# Altium schematic sheet DPPXHK_IO.SCHDOC
size A4
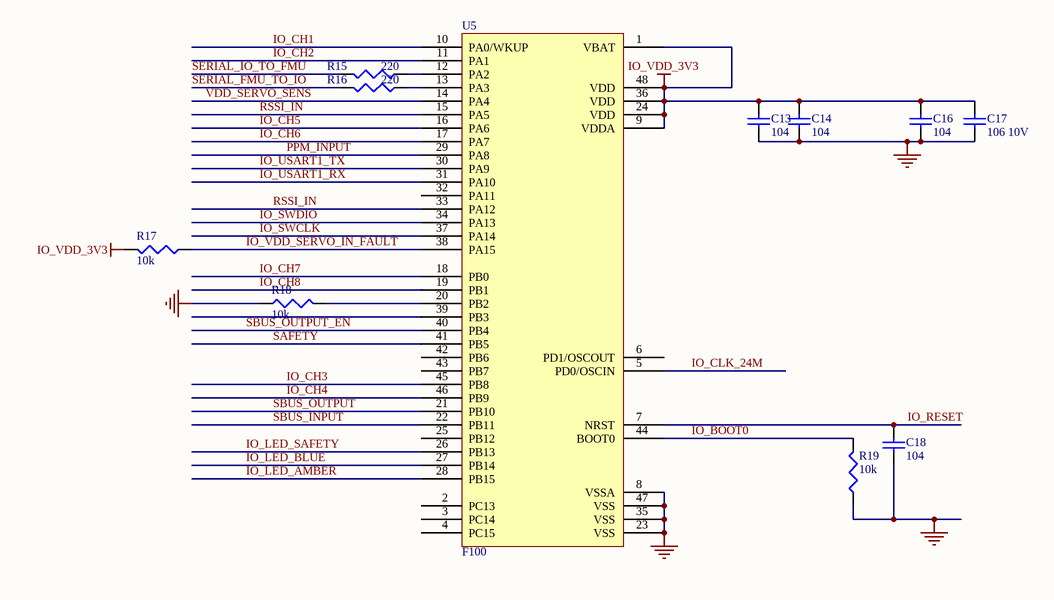
[diagram p0: DPPXHK_IO.SCHDOC]

## Parts
C13  104  [LC0402]
C14  104  [LC0402]
C16  104  [LC0402]
C17  106 10V  [LC0402]
C18  104  [LC0402]
R15  220  [0402R]
R16  220  [0402R]
R17  10k  [0402R]
R18  10k  [0402R]
R19  10k  [0402R]
U5  F100  [LQFP48_ST]

## Nets
GND: C13.2 C14.2 C16.2 C17.2 C18.1 R18.1 R19.1 U5.8(VSSA) U5.23(VSS) U5.35(VSS) U5.47(VSS)
IO_VDD_3V3: C13.1 C14.1 C16.1 C17.1 R17.2 U5.1(VBAT) U5.9(VDDA) U5.24(VDD) U5.36(VDD) U5.48(VDD)
IO_BOOT0: R19.2 U5.44(BOOT0)
IO_CH1: U5.10(PA0/WKUP)
IO_CH2: U5.11(PA1)
IO_CH3: U5.45(PB8)
IO_CH4: U5.46(PB9)
IO_CH5: U5.16(PA6)
IO_CH6: U5.17(PA7)
IO_CH7: U5.18(PB0)
IO_CH8: U5.19(PB1)
IO_CLK_24M: U5.5(PD0/OSCIN)
IO_LED_AMBER: U5.28(PB15)
IO_LED_BLUE: U5.27(PB14)
IO_LED_SAFETY: U5.26(PB13)
IO_RESET: C18.2 U5.7(NRST)
IO_SWCLK: U5.37(PA14)
IO_SWDIO: U5.34(PA13)
IO_USART1_RX: U5.31(PA10)
IO_USART1_TX: U5.30(PA9)
IO_VDD_SERVO_IN_FAULT: R17.1 U5.38(PA15)
PPM_INPUT: U5.29(PA8)
RSSI_IN: U5.15(PA5) U5.33(PA12)
SAFETY: U5.41(PB5)
SBUS_INPUT: U5.22(PB11)
SBUS_OUTPUT: U5.21(PB10)
SBUS_OUTPUT_EN: U5.40(PB4)
SERIAL_FMU_TO_IO: R16.2
SERIAL_IO_TO_FMU: R15.2
VDD_SERVO_SENS: U5.14(PA4)
NetR15_1: R15.1 U5.12(PA2)
NetR16_1: R16.1 U5.13(PA3)
NetR18_2: R18.2 U5.20(PB2)

Not connected (* = marked no-connect by the designer): U5 2(PC13) 3(PC14) 4(PC15) 6(PD1/OSCOUT) 25(PB12) 32(PA11) 39(PB3) 42(PB6) 43(PB7)

## Library data of the parts
C13 C14 C16-C18 = Cap Semi: Capacitor (Semiconductor SIM Model); Published: 8-Jun-2000; LatestRevisionDate: 17-Jul-2002; LatestRevisionNote: Re-released for DXP Platform.; PackageReference: C1206; Publisher: Altium Limited
R15-R19 = Res3: Resistor; Published: 8-Jun-2000; LatestRevisionDate: 4-Mar-2005; LatestRevisionNote: PCB Footprint replaced.; Publisher: Altium Limited